# Altium schematic sheet stm8.SchDoc
size A3
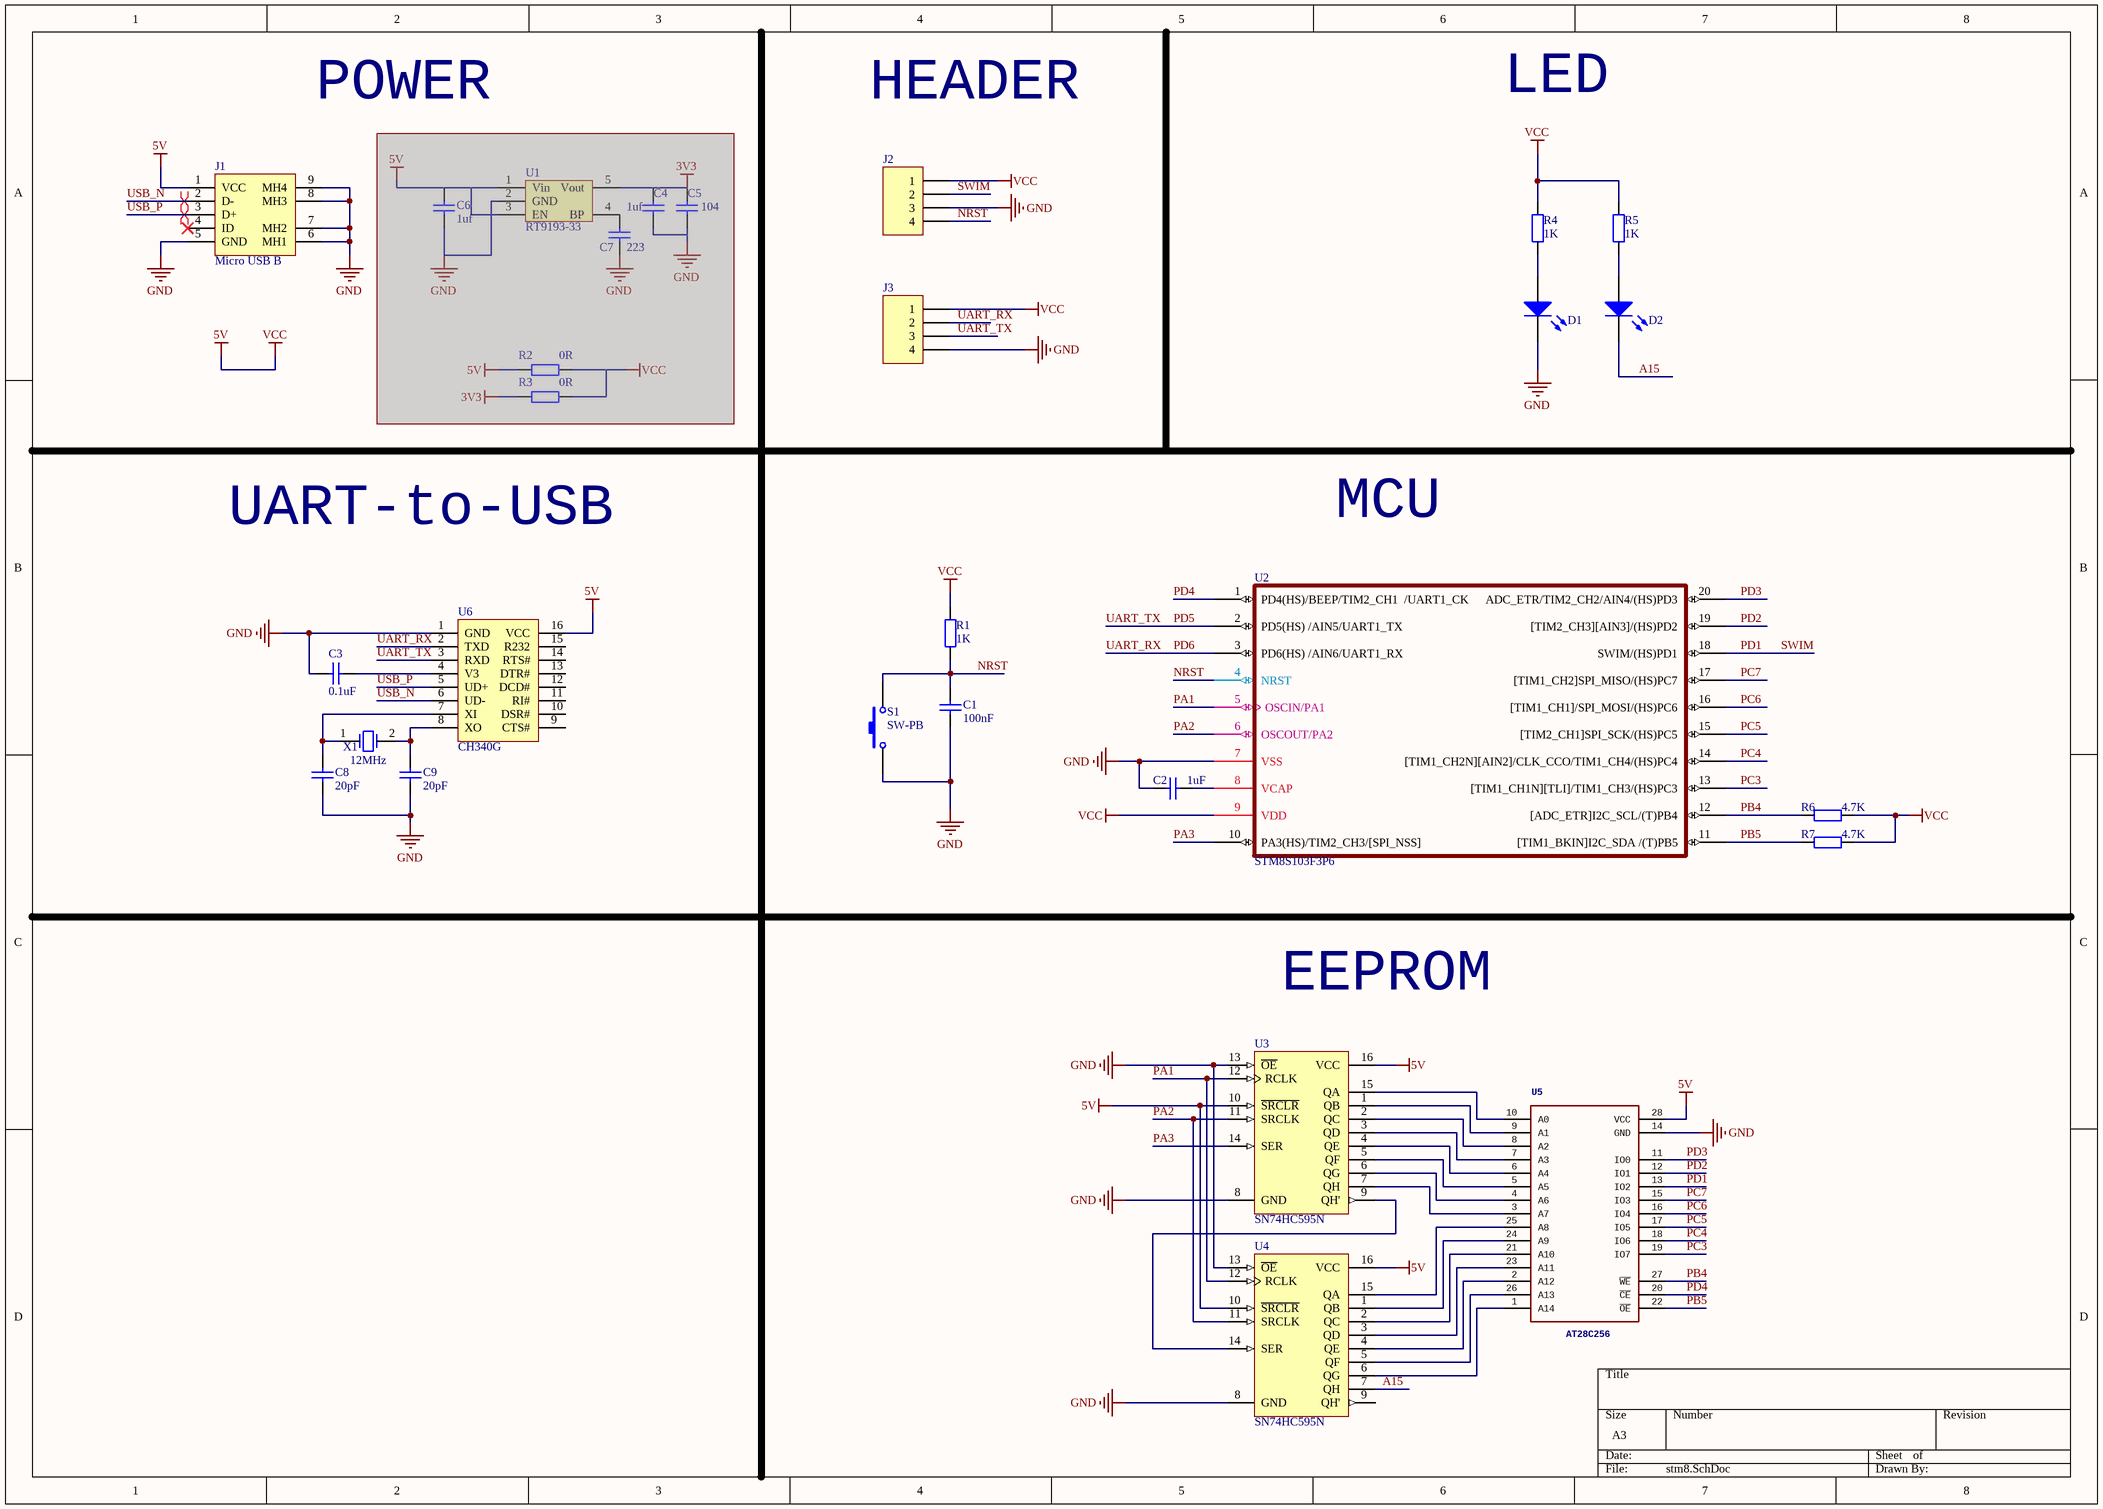
[diagram p0: stm8.SchDoc]

## Parts
C1  value 100nF  [0603_C]  (hidden comment: Cap)
C2  value 1uF  [0603_C]  (hidden comment: Cap)
C3  0.1uF  [0603_C]
C4  1uf  [0603_C]  (masked out: inside a compile mask, not in the netlist)
C5  104  [0603_C]  (masked out: inside a compile mask, not in the netlist)
C6  1uf  [0603_C]  (masked out: inside a compile mask, not in the netlist)
C7  223  [0603_C]  (masked out: inside a compile mask, not in the netlist)
C8  20pF  [0603_C]
C9  20pF  [0603_C]
D1  LED0  [0603_LED]  (value not drawn)
D2  LED0  [0603_LED]  (value not drawn)
J1  Micro USB B  [USB_MICRO_5S_B]
J2  Header 4  [HEADER_4x1]  (value not drawn)
J3  Header 4  [HEADER_4x1]  (value not drawn)
R1  value 1K  [0603_R]  (hidden comment: Res2)
R2  value 0R  [0603_R]  (hidden comment: Res2)  (masked out: inside a compile mask, not in the netlist)
R3  value 0R  [0603_R]  (hidden comment: Res2)  (masked out: inside a compile mask, not in the netlist)
R4  value 1K  [0603_R]  (hidden comment: Res2)
R5  value 1K  [0603_R]  (hidden comment: Res2)
R6  value 4.7K  [0603_R]  (hidden comment: Res2)
R7  value 4.7K  [0603_R]  (hidden comment: Res2)
S1  SW-PB  [TSW DIP-6*6*6]
U1  RT9193-33  [SOT23-5]  (masked out: inside a compile mask, not in the netlist)
U2  STM8S103F3P6  [TSSOP20]
U3  SN74HC595N  [N016]
U4  SN74HC595N  [N016]
U5  AT28C256  [DIP28-600]
U6  CH340G  [CH340G]
X1  value 12MHz  [49SMD]  (hidden comment: XTAL)

## Nets
5V: J1.1(VCC) J2.1 J3.1 R1.1 R4.1 R5.1 R6.2 R7.2 U2.9(VDD) U3.10(~{SRCLR}) U3.16(VCC) U4.10(~{SRCLR}) U4.16(VCC) U5.28(VCC) U6.16(VCC)  [also labelled VCC]
GND: C1.1 C2.1 C3.2 C8.1 C9.1 D1.2(K) J1.5(GND) J1.6(MH1) J1.7(MH2) J1.8(MH3) J1.9(MH4) J2.3 J3.4 S1.1 U2.7(VSS) U3.8(GND) U3.13(~{OE}) U4.8(GND) U4.13(~{OE}) U5.14(GND) U6.1(GND)
A15: D2.2(K) U4.7(QH)
NRST: C1.2 J2.4 R1.2 S1.2 U2.4(NRST)
PA1: U2.5(OSCIN/PA1) U3.12(RCLK) U4.12(RCLK)
PA2: U2.6(OSCOUT/PA2) U3.11(SRCLK) U4.11(SRCLK)
PA3: U2.10(PA3(HS)/TIM2_CH3/[SPI_NSS]) U3.14(SER)
PB4: R6.1 U2.12([ADC_ETR]I2C_SCL/(T)PB4) U5.27(~{WE})
PB5: R7.1 U2.11([TIM1_BKIN]I2C_SDA_/(T)PB5) U5.22(~{OE})
PC3: U2.13([TIM1_CH1N][TLI]/TIM1_CH3/(HS)PC3) U5.19(IO7)
PC4: U2.14([TIM1_CH2N][AIN2]/CLK_CCO/TIM1_CH4/(HS)PC4) U5.18(IO6)
PC5: U2.15([TIM2_CH1]SPI_SCK/(HS)PC5) U5.17(IO5)
PC6: U2.16([TIM1_CH1]/SPI_MOSI/(HS)PC6) U5.16(IO4)
PC7: U2.17([TIM1_CH2]SPI_MISO/(HS)PC7) U5.15(IO3)
PD1: J2.2 U2.18(SWIM/(HS)PD1) U5.13(IO2)  [also labelled SWIM]
PD2: U2.19([TIM2_CH3][AIN3]/(HS)PD2) U5.12(IO1)
PD3: U2.20(ADC_ETR/TIM2_CH2/AIN4/(HS)PD3) U5.11(IO0)
PD4: U2.1(PD4(HS)/BEEP/TIM2_CH1__/UART1_CK) U5.20(~{CE})
PD5: J3.3 U2.2(PD5(HS)_/AIN5/UART1_TX) U6.3(RXD)  [also labelled UART_TX]
PD6: J3.2 U2.3(PD6(HS)_/AIN6/UART1_RX) U6.2(TXD)  [also labelled UART_RX]
USB_N: J1.2(D-) U6.6(UD-)
USB_P: J1.3(D+) U6.5(UD+)
NetC2_2: C2.2 U2.8(VCAP)
NetC3_1: C3.1 U6.4(V3)
NetC8_2: C8.2 U6.7(XI) X1.1
NetC9_2: C9.2 U6.8(XO) X1.2
NetD1_1: D1.1(A) R4.2
NetD2_1: D2.1(A) R5.2
NetU3_1: U3.1(QB) U5.9(A1)
NetU3_2: U3.2(QC) U5.8(A2)
NetU3_3: U3.3(QD) U5.7(A3)
NetU3_4: U3.4(QE) U5.6(A4)
NetU3_5: U3.5(QF) U5.5(A5)
NetU3_6: U3.6(QG) U5.4(A6)
NetU3_7: U3.7(QH) U5.3(A7)
NetU3_9: U3.9(QH') U4.14(SER)
NetU3_15: U3.15(QA) U5.10(A0)
NetU4_1: U4.1(QB) U5.24(A9)
NetU4_2: U4.2(QC) U5.21(A10)
NetU4_3: U4.3(QD) U5.23(A11)
NetU4_4: U4.4(QE) U5.2(A12)
NetU4_5: U4.5(QF) U5.26(A13)
NetU4_6: U4.6(QG) U5.1(A14)
NetU4_15: U4.15(QA) U5.25(A8)

Not connected (* = marked no-connect by the designer): J1 4(ID)*; U4 9(QH'); U6 9(CTS#) 10(DSR#) 11(RI#) 12(DCD#) 13(DTR#) 14(RTS#) 15(R232)

## Layout directives
differential pair: USB_N, USB_P

## Notes on the sheet
- POWER
- HEADER
- LED
- UART-to-USB
- MCU
- EEPROM

## Library data of the parts
C1 C2 = Cap: Capacitor; Published: 8-Jun-2000; LatestRevisionDate: 17-Jul-2002; LatestRevisionNote: Re-released for DXP Platform.; PackageReference: RAD-0.3; Publisher: Altium Limited; PackageDescription: Radial Cap, Thru-Hole; 2 Leads; 0.3 in Pin Spacing
C3 C8 C9 = CAP: Capacitor; value: 1uF
C4 C6 C7 = CAP: Capacitor
  C4 C6: value: 1uF
  C7: value: 223
C5 = CAP: Capacitor; value: 0.1uF
D1 D2 = LED0: Typical INFRARED GaAs LED; Published: 8-Jun-2000; LatestRevisionDate: 08-Jul-2005; LatestRevisionNote: Mech Layer 1 removed.; PackageReference: LED-0; Publisher: Altium Limited; PackageDescription: LED; 2 Leads
J2 J3 = Header 4: Header, 4-Pin; LatestRevisionDate: 17-Jul-2002; LatestRevisionNote: Re-released for DXP Platform.; Publisher: Altium Limited
R1-R7 = Res2: Resistor; Published: 8-Jun-2000; LatestRevisionDate: 17-Jul-2002; LatestRevisionNote: Re-released for DXP Platform.; PackageReference: AXIAL-0.4; Publisher: Altium Limited; PackageDescription: Axial Device, Thru-Hole; 2 Leads; 0.4 in Pin Spacing
S1 = SW-PB: Switch; Published: 24-Mar-1999; LatestRevisionDate: 17-Jul-2002; LatestRevisionNote: Re-released for DXP Platform.; PackageReference: SPST-2; Publisher: Altium Limited; PackageDescription: Switch; 2 Leads
U2 = STM8S103F3P6: ST 8-bit  Microcontroller
U3 U4 = SN74HC595N: 8-Bit Shift Register with 3-State Output Registers; Published: 8-Jun-2000; LatestRevisionDate: 04-Mar-2005; LatestRevisionNote: Stylized 3D Model Added.; DatasheetVersion: May-1997; PackageVersion: Oct-1995; PackageReference: N016; Publisher: Altium Limited; PackageDescription: DIP; 16 Leads; Row Spacing 7.62 mm; Pitch 2.54 mm; Code_JEDEC: MS-001-BB; ComponentLink1Description: Manufacturer Link; ComponentLink1URL: http://www.ti.com/; ComponentLink2Description: Datasheet; ComponentLink2URL: http://www-s.ti.com/sc/ds/sn74hc595.pdf
U5 = AT28C256: EEPROM 32Kx8 256k bit   The AT28C256 is a high-performance Electrically Erasable and Programmable Read Only Memory. Its 256K of memory is organized as 32,768 words by 8 bits.